# EAGLE design DVP_board (EAGLE 7.2.0)
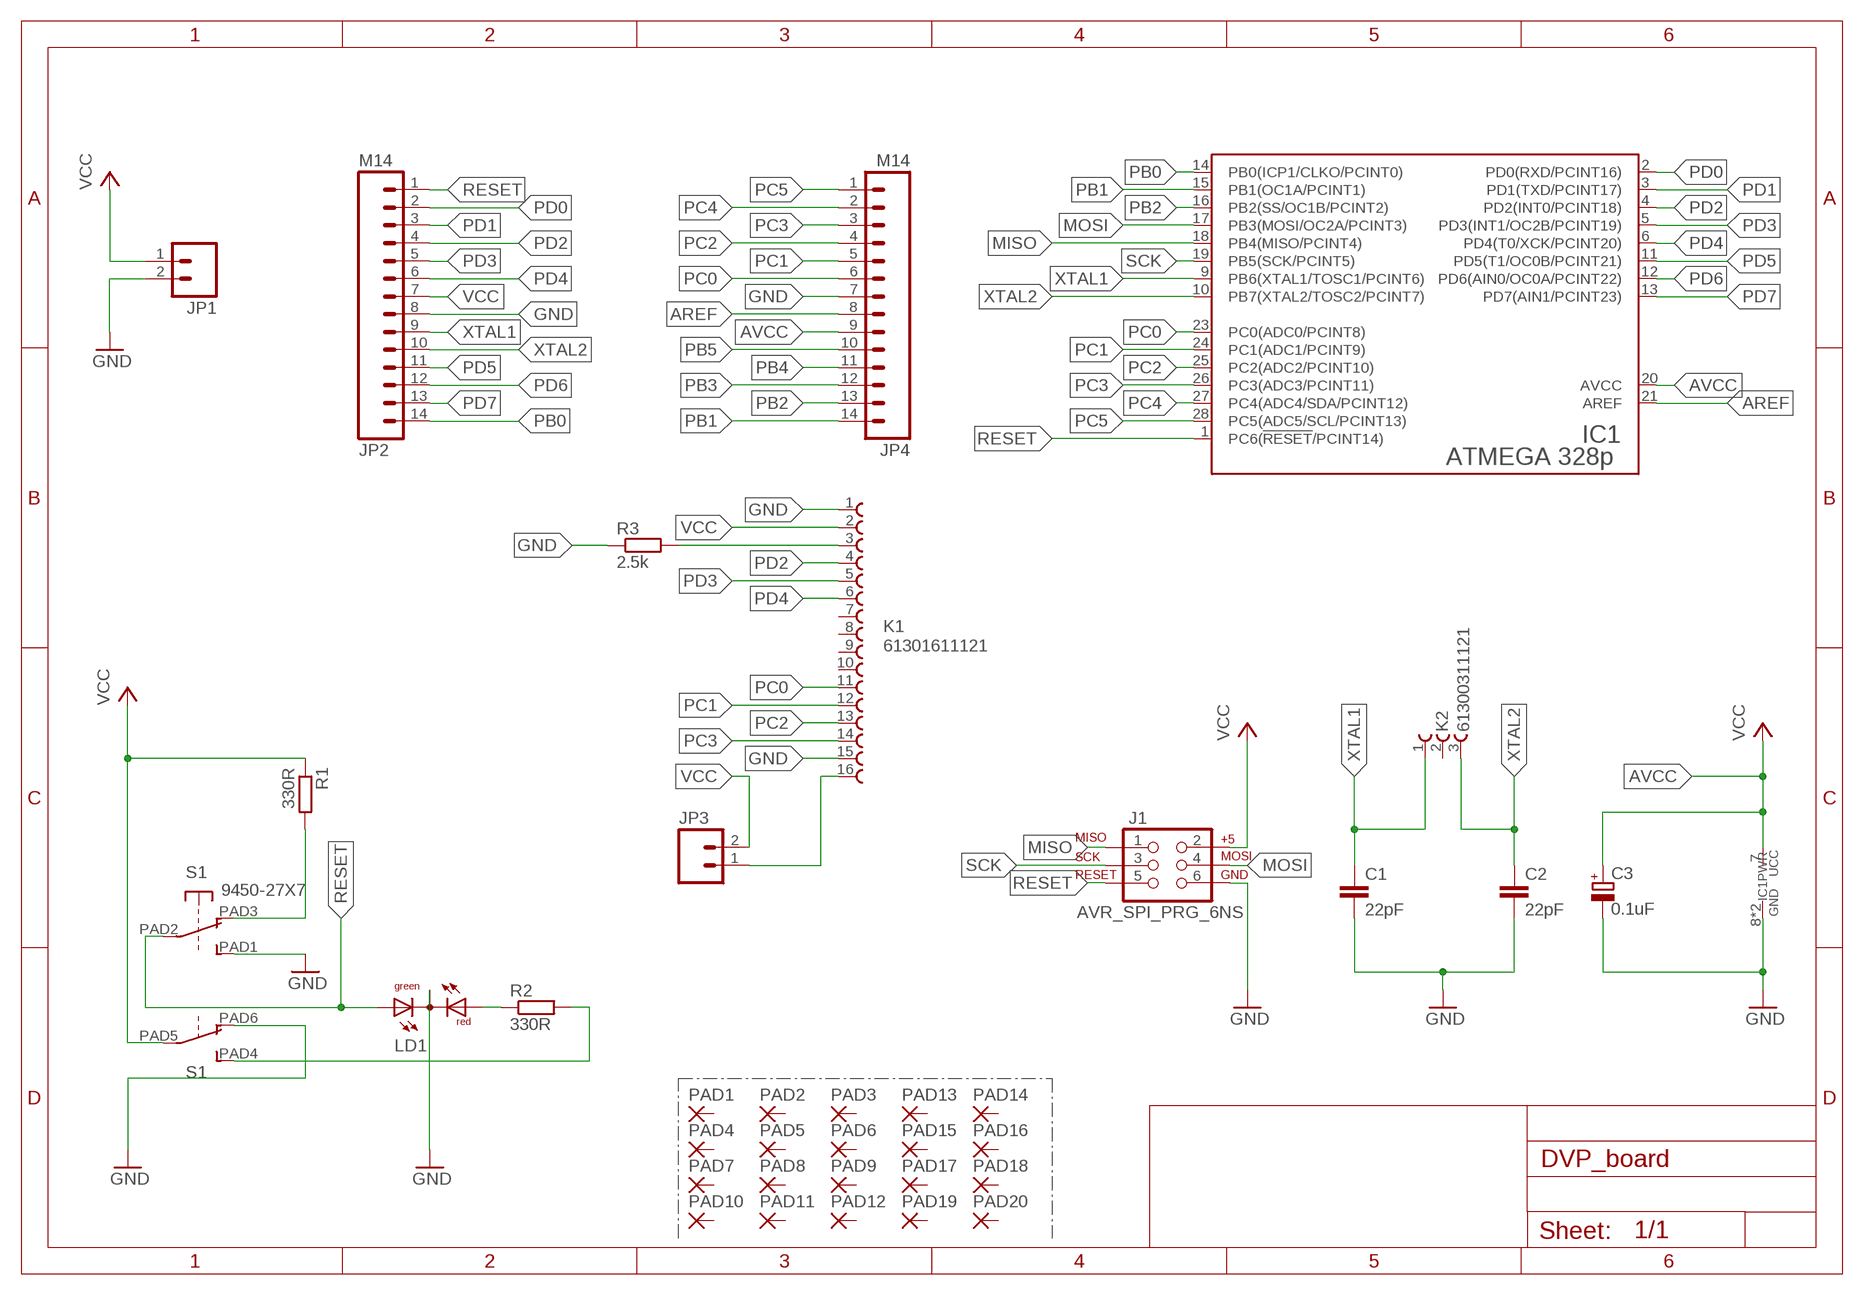
[diagram p0: schematic, sheet 1]

## Parts
C1  22pF  CAPPTH1  [CAP-PTH-5MM]
C2  22pF  CAPPTH1  [CAP-PTH-5MM]
C3  0.1uF  CPOL-EUE2-4  [E2-4]
IC1  ATMEGA 328p  ATMEGA48/88/168/328-PU(DIP28)28-3  [DIL28-3]
J1  AVR_SPI_PRG_6NS  [2X3-NS]
JP1  M025MM  [SCREWTERMINAL-5MM-2]
JP2  M14  [1X14]
JP3  M02PTH  [1X02]
JP4  M14  [1X14]
K1  61301611121  [61301611121]
K2  61300311121  [61300311121]
LD1  DUOLED-RG-C  [DUOLED-C-5MM]
PAD1  1,6/0,8  [1,6/0,8]
PAD2  1,6/0,8  [1,6/0,8]
PAD3  1,6/0,8  [1,6/0,8]
PAD4  1,6/0,8  [1,6/0,8]
PAD5  1,6/0,8  [1,6/0,8]
PAD6  1,6/0,8  [1,6/0,8]
PAD7  1,6/0,8  [1,6/0,8]
PAD8  1,6/0,8  [1,6/0,8]
PAD9  1,6/0,8  [1,6/0,8]
PAD10  1,6/0,8  [1,6/0,8]
PAD11  1,6/0,8  [1,6/0,8]
PAD12  1,6/0,8  [1,6/0,8]
PAD13  1,6/0,8  [1,6/0,8]
PAD14  1,6/0,8  [1,6/0,8]
PAD15  1,6/0,8  [1,6/0,8]
PAD16  1,6/0,8  [1,6/0,8]
PAD17  1,6/0,8  [1,6/0,8]
PAD18  1,6/0,8  [1,6/0,8]
PAD19  1,6/0,8  [1,6/0,8]
PAD20  1,6/0,8  [1,6/0,8]
R1  330R  R-EU_0207/10  [0207/10]
R2  330R  R-EU_0207/10  [0207/10]
R3  2.5k  R-EU_0207/10  [0207/10]
S1  9450-27X7  [DPDT_7X7]

## Nets
AREF: IC1.21(AREF) JP4.8
AVCC: C3.+ IC1.7(UCC) IC1.20(AVCC) JP4.9 ; supply symbol labelled VCC
GND: C1.2 C2.2 C3.- IC1.8(GND) IC1.22(GND) J1.6 JP1.2 JP2.8 JP4.7 K1.1 K1.3 K1.15 LD1.C R3.1 R3.2 S1.PAD1(1:S) S1.PAD6(2:O)
MISO: IC1.18(PB4(MISO/PCINT4)) J1.1
MOSI: IC1.17(PB3(MOSI/OC2A/PCINT3)) J1.4
N$1: R1.2 S1.PAD3(1:O)
N$2: LD1.AR R2.1
N$4: R2.2 S1.PAD4(2:S)
PB0: IC1.14(PB0(ICP1/CLKO/PCINT0)) JP2.14
PB1: IC1.15(PB1(OC1A/PCINT1)) JP4.14
PB2: IC1.16(PB2(SS/OC1B/PCINT2)) JP4.13
PB3: JP4.12
PB4: JP4.11
PB5: JP4.10
PC0: IC1.23(PC0(ADC0/PCINT8)) JP4.6 K1.11
PC1: IC1.24(PC1(ADC1/PCINT9)) JP4.5 K1.12
PC2: IC1.25(PC2(ADC2/PCINT10)) JP4.4 K1.13
PC3: IC1.26(PC3(ADC3/PCINT11)) JP4.3 K1.14
PC4: IC1.27(PC4(ADC4/SDA/PCINT12)) JP4.2
PC5: IC1.28(PC5(ADC5/SCL/PCINT13)) JP4.1
PD0: IC1.2(PD0(RXD/PCINT16)) JP2.2
PD1: IC1.3(PD1(TXD/PCINT17)) JP2.3
PD2: IC1.4(PD2(INT0/PCINT18)) JP2.4 K1.4
PD3: IC1.5(PD3(INT1/OC2B/PCINT19)) JP2.5 K1.5
PD4: IC1.6(PD4(T0/XCK/PCINT20)) JP2.6 K1.6
PD5: IC1.11(PD5(T1/OC0B/PCINT21)) JP2.11
PD6: IC1.12(PD6(AIN0/OC0A/PCINT22)) JP2.12
PD7: IC1.13(PD7(AIN1/PCINT23)) JP2.13
RESET: IC1.1(PC6(!RESET!/PCINT14)) J1.5 JP2.1 LD1.AX(AG) S1.PAD2(1:P)
SCK: IC1.19(PB5(SCK/PCINT5)) J1.3
VCC: J1.2 JP1.1 JP2.7 JP3.1 JP3.2 K1.2 K1.16 R1.1 S1.PAD5(2:P)
XTAL1: C1.1 IC1.9(PB6(XTAL1/TOSC1/PCINT6)) JP2.9 K2.1
XTAL2: C2.1 IC1.10(PB7(XTAL2/TOSC2/PCINT7)) JP2.10 K2.3
Unconnected: K1.7 K1.8 K1.9 K1.10 K2.2 PAD1.1(P) PAD2.1(P) PAD3.1(P) PAD4.1(P) PAD5.1(P) PAD6.1(P) PAD7.1(P) PAD8.1(P) PAD9.1(P) PAD10.1(P) PAD11.1(P) PAD12.1(P) PAD13.1(P) PAD14.1(P) PAD15.1(P) PAD16.1(P) PAD17.1(P) PAD18.1(P) PAD19.1(P) PAD20.1(P)

## Library data of the parts
C1 C2 = SparkFun:CAP: Capacitor Standard 0603 ceramic capacitor, and 0.1" leaded capacitor.
C3 = rcl:CPOL-EU: POLARIZED CAPACITOR, European symbol
IC1 = AAA:ATMEGA48/88/168/328-PU(DIP28): ATMEGA 328 DIP
J1 = AAA:AVR_SPI_PRG_6: AVR ISP 6 Pin This is the reduced ISP connector for AVR programming. Common on Arduino. This footprint will take up less PCB space and can be used with a 10-pin to 6-pin adapter such as SKU: BOB-08508
JP1 = AAA:M02: Header 2 Standard 2-pin 0.1" header. Use with straight break away headers (SKU : PRT-00116), right angle break away headers (PRT-00553), swiss pins (PRT-00743), machine pins (PRT-00117), and female headers (PRT-00115). Molex polarized connector foot print use with SKU : PRT-08233 with associated crimp pins and housings.
JP2 JP4 = SparkFun:M14: Header 14 Standard 14-pin 0.1" header. Use with straight break away headers (SKU : PRT-00116), right angle break away headers (PRT-00553), swiss pins (PRT-00743), machine pins (PRT-00117), and female headers (PRT-00115).
JP3 = SparkFun:M02: Header 2 Standard 2-pin 0.1" header. Use with straight break away headers (SKU : PRT-00116), right angle break away headers (PRT-00553), swiss pins (PRT-00743), machine pins (PRT-00117), and female headers (PRT-00115). Molex polarized connector foot print use with SKU : PRT-08233 with associated crimp pins and housings.
K1 = Wurth_Elektronik_Electromechanic_Board_to_Board_Connectors_rev15c:61301611121: WR-PHD 2.54mm Pin Header, 16 Pins =>Code : Con_BTB_PHD_2.54_1_THT_61301611121 <http://katalog.we-online.de/media/images/eican/Con_BTB_PHD_2.54_1_THT_6130xx11121_pf2.jpg> Details see: http://katalog.we-online.de/en/em/613_0xx_111_21 Created 2014-05-29, Karrer Zheng 2014 (C) Würth Elektronik
K2 = Wurth_Elektronik_Electromechanic_Board_to_Board_Connectors_rev15c:61300311121: WR-PHD 5.54mm Pin Header, 3 Pin =>Code : Con_BTB_PHD_2.54_1_THT_61300311121 <http://katalog.we-online.de/media/images/eican/Con_BTB_PHD_2.54_1_THT_6130xx11121_pf2.jpg> Details see: http://katalog.we-online.de/en/em/613_0xx_111_21 Created 2014-05-29, Karrer Zheng 2014 (C) Würth Elektronik
LD1 = led:DUOLED-RG-C: DUO LED 2 colors (red/green), 5 mm, round, common Cathode www.ligitek.com or other producers.
PAD1-PAD20 = wirepad:1,6/0,8: THROUGH-HOLE PAD
R1-R3 = rcl:R-EU_: RESISTOR, European symbol
S1 = switch-misc:9450-2: MARQUARDT SWITCH

## Net classes
0 default: width 1.143 mm
1 ground: width 1.27 mm

## Board
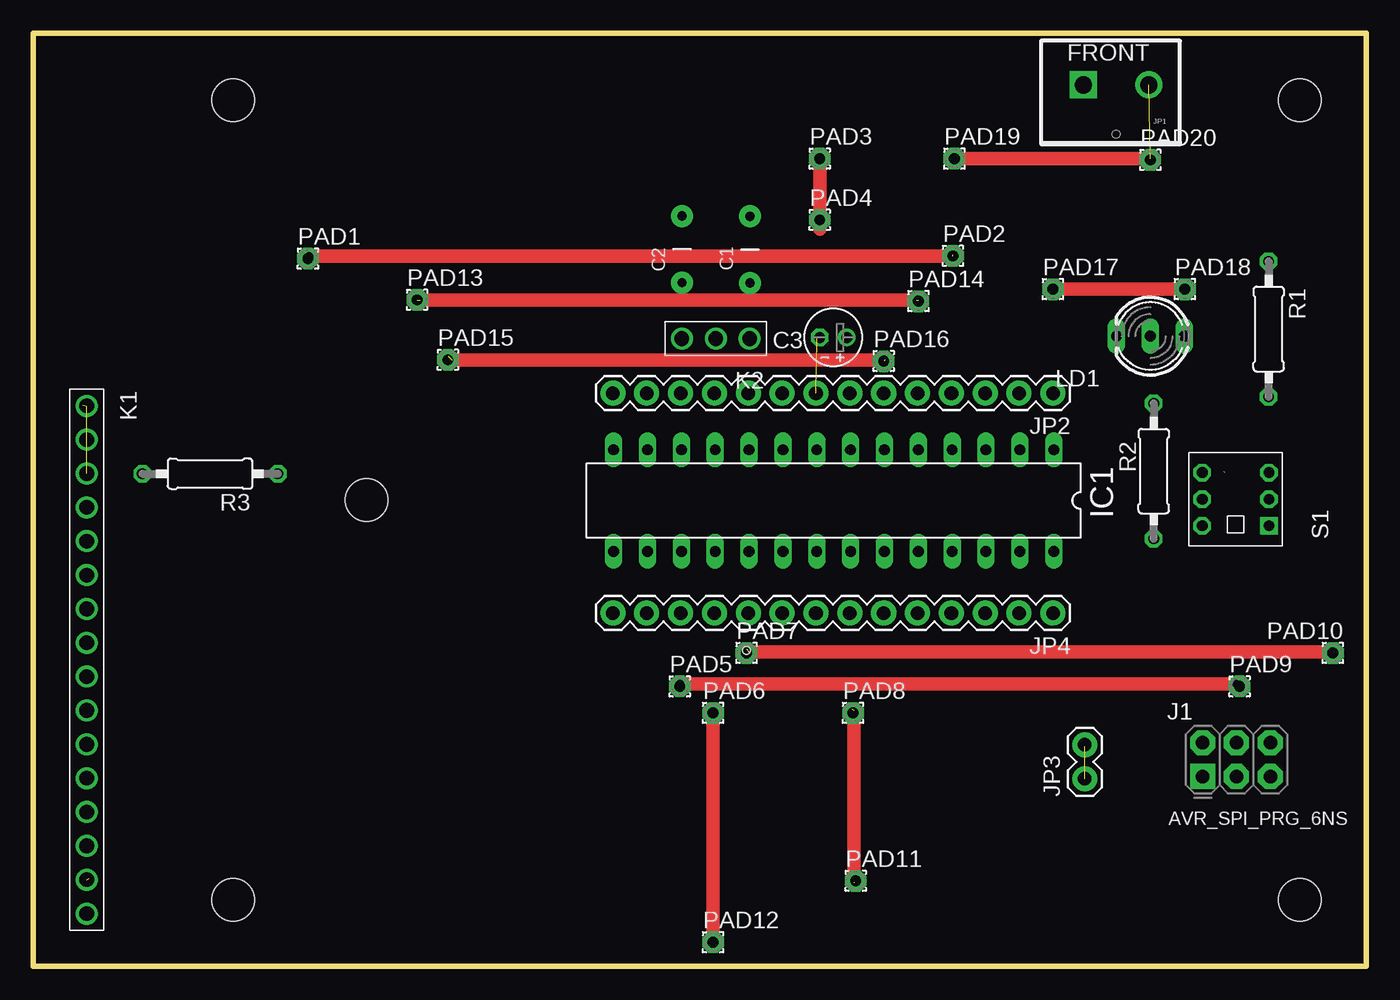
[diagram p1: board, top side]
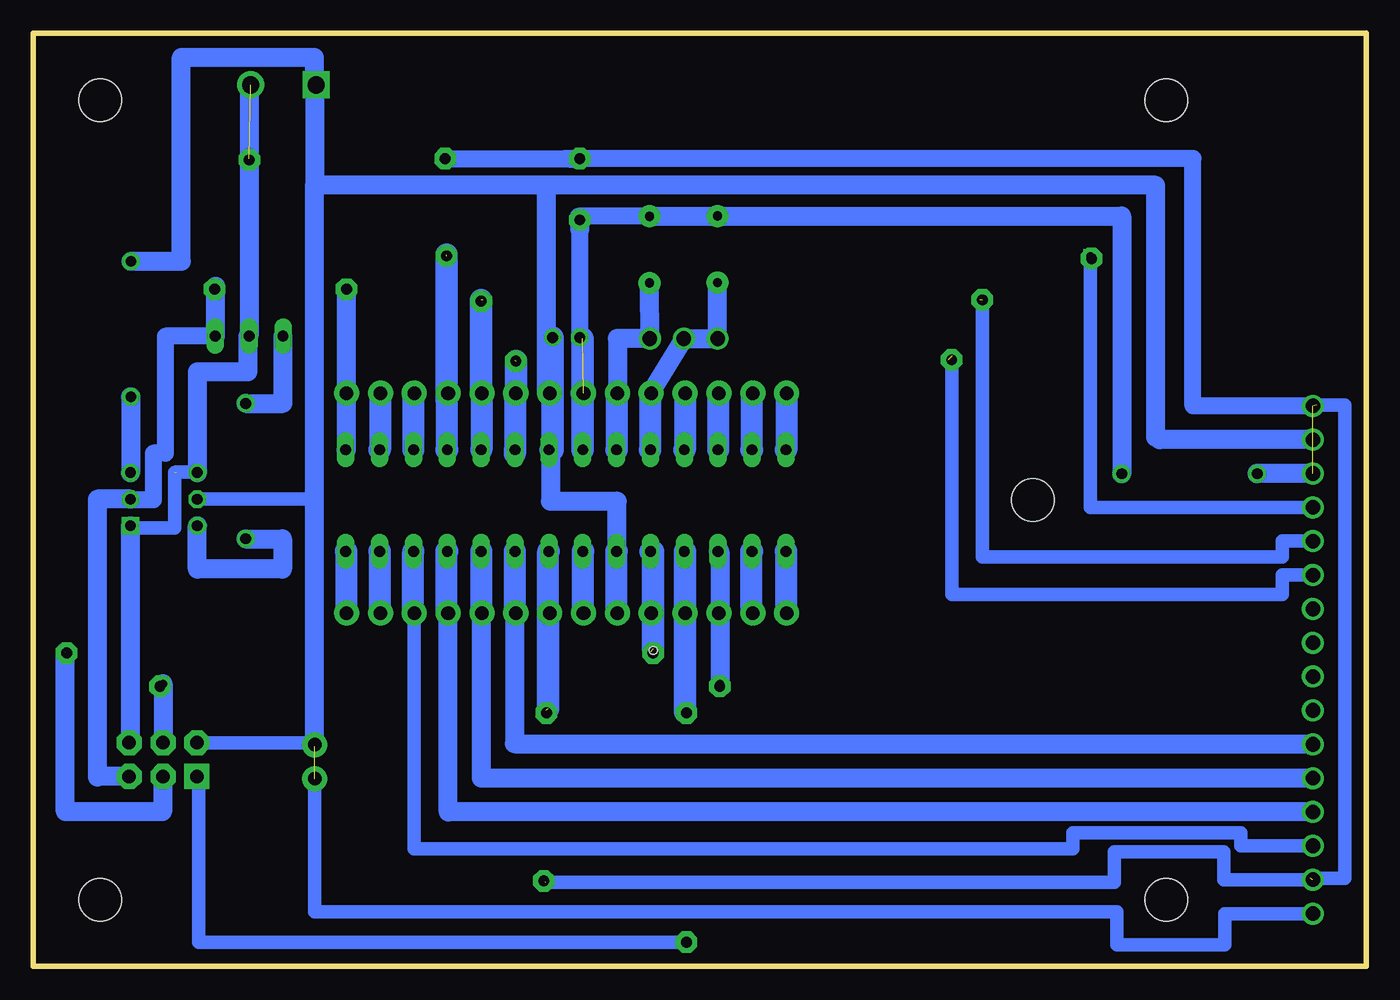
[diagram p2: board, bottom side, seen from below]

Size 100 x 70 mm. Coordinates in mm from the lower left corner, seen from the top.
Outline: 0,70 100,70 100,0 0,0 0,70
Copper layers (1*16): Top 0.035mm / dielectric 1.5mm / Bottom 0.035mm
Design rules "default": minimum track width 10mil, minimum drill 24mil, track to track 8mil, track to pad 8mil, pad to pad 8mil, via to via 8mil, smd to smd 8mil, copper to edge 40mil, drill to drill 8mil, minimum pad ring 10mil, minimum via ring 8mil, stop-mask expansion 4mil, vias tented up to drill 0mil, thermal gap 10mil
Holes 3.2 mm at 25,35 15,65 95,65 95,5 15,5
Holes 0.6 mm at 53.5,23.7

### Footprints (pad centres in the part's own frame; a part is rotated, then mirrored left to right if it is on the bottom)
CAP-PTH-5MM = drill 0.7 pad 1.651: 1 -2.5,0; 2 2.5,0
E2-4 = drill 0.813 pad 1.27: + -1.016,0 | drill 0.813 pad 1.27 octagon: - 1.016,0
DIL28-3 = drill 0.813 long: 1 -16.51,-3.81; 2 -13.97,-3.81; 3 -11.43,-3.81; 4 -8.89,-3.81; 5 -6.35,-3.81; 6 -3.81,-3.81; 7 -1.27,-3.81; 8 1.27,-3.81; 9 3.81,-3.81; 10 6.35,-3.81; 11 8.89,-3.81; 12 11.43,-3.81; 13 13.97,-3.81; 14 16.51,-3.81; 15 16.51,3.81; 16 13.97,3.81; 17 11.43,3.81; 18 8.89,3.81; 19 6.35,3.81; 20 3.81,3.81; 21 1.27,3.81; 22 -1.27,3.81; 23 -3.81,3.81; 24 -6.35,3.81; 25 -8.89,3.81; 26 -11.43,3.81; 27 -13.97,3.81; 28 -16.51,3.81
2X3-NS = drill 1.016 pad 1.88 square: 1 -2.54,-1.27 | drill 1.016 pad 1.88 octagon: 2 -2.54,1.27; 3 0,-1.27; 4 0,1.27; 5 2.54,-1.27; 6 2.54,1.27
SCREWTERMINAL-5MM-2 = drill 1.3 pad 2.032 square: 1 4.953,0 | drill 1.3 pad 2.032: 2 0.047,0
1X14 = drill 1.016 pad 1.88: 1 0,0; 2 2.54,0; 3 5.08,0; 4 7.62,0; 5 10.16,0; 6 12.7,0; 7 15.24,0; 8 17.78,0; 9 20.32,0; 10 22.86,0; 11 25.4,0; 12 27.94,0; 13 30.48,0; 14 33.02,0
1X02 = drill 1.016 pad 1.88: 1 0,0; 2 2.54,0
61301611121 = drill 1.1: 1 -19.05,0; 2 -16.51,0; 3 -13.97,0; 4 -11.43,0; 5 -8.89,0; 6 -6.35,0; 7 -3.81,0; 8 -1.27,0; 9 1.27,0; 10 3.81,0; 11 6.35,0; 12 8.89,0; 13 11.43,0; 14 13.97,0; 15 16.51,0; 16 19.05,0
61300311121 = drill 1.1: 1 -2.54,0; 2 0,0; 3 2.54,0
DUOLED-C-5MM = drill 0.813 long: AR 2.54,0; AX -2.54,0; C 0,0
1,6/0,8 = drill 0.813 pad 1.6 octagon: 1 0,0
0207/10 = drill 0.813 octagon: 1 -5.08,0; 2 5.08,0
DPDT_7X7 = drill 0.8 square: PAD1 -2,-2.5 | drill 0.8 octagon: PAD2 0,-2.5; PAD3 2,-2.5; PAD4 -2,2.5; PAD5 0,2.5; PAD6 2,2.5

### Placement (x,y rotation side)
C1  53.77,53.77 90 top
C2  48.67,53.79 90 top
C3  60.02,47.18 180 top
IC1  60.05,34.94 180 top
J1  90.27,15.5 0 top
JP1  83.74,66.13 180 top
JP2  76.5,43 180 top
JP3  78.89,14.07 90 top
JP4  76.5,26.5 180 top
K1  4,23 270 top
K2  51.2,47.1 180 top
LD1  83.81,47.28 180 top
PAD1  20.6,53.1 0 top
PAD2  69,53.3 0 top
PAD3  59,60.6 0 top
PAD4  59,56 0 top
PAD5  48.5,21 0 top
PAD6  51,19 0 top
PAD7  53.5,23.5 0 top
PAD8  61.5,19 0 top
PAD9  90.5,21 0 top
PAD10  97.5,23.5 0 top
PAD11  61.7,6.4 0 top
PAD12  51,1.8 0 top
PAD13  28.8,50 0 top
PAD14  66.4,49.9 0 top
PAD15  31.1,45.5 0 top
PAD16  63.8,45.4 0 top
PAD17  76.5,50.8 0 top
PAD18  86.4,50.8 0 top
PAD19  69.1,60.6 0 top
PAD20  83.8,60.5 0 top
R1  92.68,47.81 270 top
R2  84.06,37.15 270 top
R3  13.26,36.95 180 top
S1  90.2,35.04 90 top

### Tracks (layer width: path | path; a pad name or v marks a point on that pad's centre or on a via)
AREF
  Bottom 1.651: IC1.21 58.75,31.12 58.75,26.5 JP4.8
AVCC  (via drill 0.6)  (1 unrouted)
  Bottom 1.422: IC1.7 v61.2,38.75 | v61.2,38.75 61.2,34.9 56.24,34.9 | 56.2,34.9 56.24,34.9 | 56.24,34.9 IC1.20 | v61.2,38.75 61.04,38.75
  Bottom 1.651: IC1.20 56.25,26.5 JP4.9
  Bottom 1.676: 61.04,38.75 C3.+
GND  (via drill 0.6)  (9 unrouted)
  Top 1.016: v69.1,60.6 83.8,60.6 | v59,60.5 59,55.3 | 61.57,19.2 61.57,6.3
  Bottom 1.016: K1.15 10.7,6.49 10.7,8.6 18.9,8.6 18.9,6.3 61.6,6.3 | 89.4,37.04 89.4,32.9 92.7,32.9 | 89.3,37.1 87.7,37.1 | 3.7,42.1 1.6,42.1 1.6,6.6 4.2,6.6
  Bottom 1.27: C1.2 59.1,56.27 59.1,56.2 59,56.2 | 59,55.3 C3.- 58.9,47.18 58.9,47.1 58.78,47.1 | v69.1,60.6 60.1,60.6 | 60.1,60.6 v59,60.5 | K1.1 13,42.05 13,60.6 60.1,60.6
  Bottom 1.422: 58.68,42.95 JP2.8 59,43 | C1.2 50.97,56.27 C2.2 18.34,56.29 R3.1 | JP1.2 83.81,66.13 LD1.C 83.9,47.28 83.9,44.6 87.7,44.6 87.7,37.1 S1.PAD6 | JP4.7 61.4,26.5 | J1.6 92.7,16.77 92.7,32.9 S1.PAD1 92.7,33 | K1.3 8.18,36.97 R3.2 | 59,56.2 59,55.3
  Bottom 1.651: IC1.22 61.38,31.12 61.38,26.5 JP4.7
  Bottom 1.676: 61.4,26.5 61.4,19.3 | 58.78,47.1 IC1.8
MISO  (via drill 0.6)
  Top 1.016: v51,19.1 v51,1.8
  Bottom 0.406: 51.3,1.8 v51,1.8 | 51.1,19.1 v51,19.1
  Bottom 1.016: 87.6,14.23 87.6,1.8 51.3,1.8 | 51.2,26.2 51.1,26.3
  Bottom 1.422: IC1.18 51.1,31.13 | 51.1,26.3 51.1,26.2 51.2,26.2 | J1.1 87.6,14.23
  Bottom 1.676: 51.1,31.13 51.1,26.3 51.1,19.1
MOSI  (via drill 0.6)
  Top 1.016: v48.5,21.2 v90.27,21.2
  Bottom 1.422: IC1.17 48.5,31.13 v48.5,21.2 | v90.27,21.2 J1.4
N$1
  Bottom 1.422: R1.2 92.7,42.73 S1.PAD3
N$2
  Bottom 1.422: R2.1 81.27,42.23 LD1.AR
N$4
  Bottom 1.422: R2.2 81.3,32.07 81.3,29.8 87.7,29.8 S1.PAD4
PB0
  Bottom 1.651: IC1.14 43.5,38.75 43.5,43 JP2.14
PB1
  Bottom 1.651: IC1.15 43.5,31.12 43.5,26.5 JP4.14
PB2
  Bottom 1.651: IC1.16 46.12,31.12 46.12,26.5 JP4.13
PC0
  Bottom 1.422: JP4.6 63.9,26.5 63.9,16.7 4,16.7 K1.11
  Bottom 1.651: IC1.23 63.88,31.12 63.88,26.5 JP4.6
PC1
  Bottom 1.422: K1.12 66.38,14.11 66.38,27.5
  Bottom 1.651: IC1.24 66.38,31.12 66.38,27.5 66.38,26.5 JP4.5
PC2
  Bottom 1.422: JP4.4 68.88,11.57 K1.13
  Bottom 1.651: IC1.25 69,31.12 69,26.5 JP4.4
PC3
  Bottom 1.016: K1.14 9.4,9.03 9.4,10 22,10 22,8.8 71.42,8.8 JP4.3
  Bottom 1.651: IC1.26 71.5,31.12 71.5,26.5 JP4.3
PC4
  Bottom 1.651: IC1.27 74,31.12 74,26.5 JP4.2
PC5
  Bottom 1.651: JP4.1 76.5,31.12 IC1.28
PD0
  Bottom 1.651: IC1.2 74,38.75 74,43 JP2.2
PD1
  Bottom 1.651: IC1.3 71.5,38.75 71.5,43 JP2.3
PD2  (via drill 0.6)  (1 unrouted)
  Top 1.016: v20.7,53.3 v69,53.3
  Bottom 1.016: K1.4 20.7,34.43 v20.7,53.3
  Bottom 1.422: JP2.4 69,42.5
  Bottom 1.651: IC1.4 69,38.75 69,42.5 69,43 JP2.4
  Bottom 1.676: 69,42.5 69,53.4
PD3  (2 unrouted)
  Top 1.016: 66.27,50 29,50
  Bottom 1.016: K1.5 6.3,31.89 6.3,30.7 28.8,30.7 28.8,50
  Bottom 1.422: JP2.5 66.4,43
  Bottom 1.651: IC1.5 66.38,38.75 66.38,43 JP2.5
  Bottom 1.676: 66.4,43 66.4,50
PD4  (2 unrouted)
  Top 1.016: 63.9,45.5 31.4,45.5
  Bottom 1.016: K1.6 6.3,29.35 6.3,27.9 31.1,27.9 31.1,45.8
  Bottom 1.651: IC1.6 63.88,38.45 63.88,42.7 JP2.6
  Bottom 1.676: JP2.6 63.8,45.4
PD5
  Bottom 1.651: IC1.11 51.12,38.75 51.12,43 JP2.11
PD6
  Bottom 1.651: IC1.12 48.62,43 JP2.12
PD7
  Bottom 1.651: IC1.13 46.12,38.75 46.12,43 JP2.13
RESET  (via drill 0.6)
  Top 1.016: v76.5,50.8 v86.3,50.8
  Bottom 1.27: LD1.AX 90.1,47.28 90.1,38.5 91,38.5 91,35 92.7,35 S1.PAD2
  Bottom 1.422: S1.PAD2 95.2,35.04 95.2,14.23 | J1.5 95.2,14.23 | 95.2,14.23 95.2,14.2 | IC1.1 76.5,38.75 JP2.1 v76.5,50.8 | v86.3,50.8 86.3,51 86.35,51 LD1.AX
SCK  (2 unrouted)
  Top 1.016: 97.6,23.6 53.7,23.6
  Bottom 1.422: J1.3 90.3,14.23 90.3,11.6 97.6,11.6 97.6,23.6
  Bottom 1.676: IC1.19 53.5,31.13 53.5,23.8
VCC  (1 unrouted)
  Bottom 1.016: K1.16 10.6,3.95 10.6,1.6 18.7,1.6 18.7,4.1 78.89,4.1 JP3.1 | J1.2 78.89,16.77 JP3.2 78.9,16.5 | S1.PAD5 78.9,35.04
  Bottom 1.422: JP1.1 78.9,66.13 | 78.9,66.13 78.9,68.2 88.9,68.2 88.9,52.89 R1.1 | K1.2 15.5,39.51 15.5,39.7 15.8,39.7 15.8,58.6 61.5,58.6 | 61.5,58.6 78.9,58.6 | JP2.7 61.5,43 61.5,58.6 | JP3.2 78.9,35.04 78.9,58.6 | 78.9,66.13 78.9,58.6
XTAL1
  Bottom 1.422: JP2.9 56.18,47.1 K2.1 53.77,51 C1.1
  Bottom 1.651: IC1.9 56.25,43 JP2.9
XTAL2
  Bottom 1.422: JP2.10 53.7,43 51.2,47.1 K2.3 48.67,47.3 C2.1
  Bottom 1.651: IC1.10 53.75,38.75 53.75,43 JP2.10

### Text on the board
tDocu: + | -